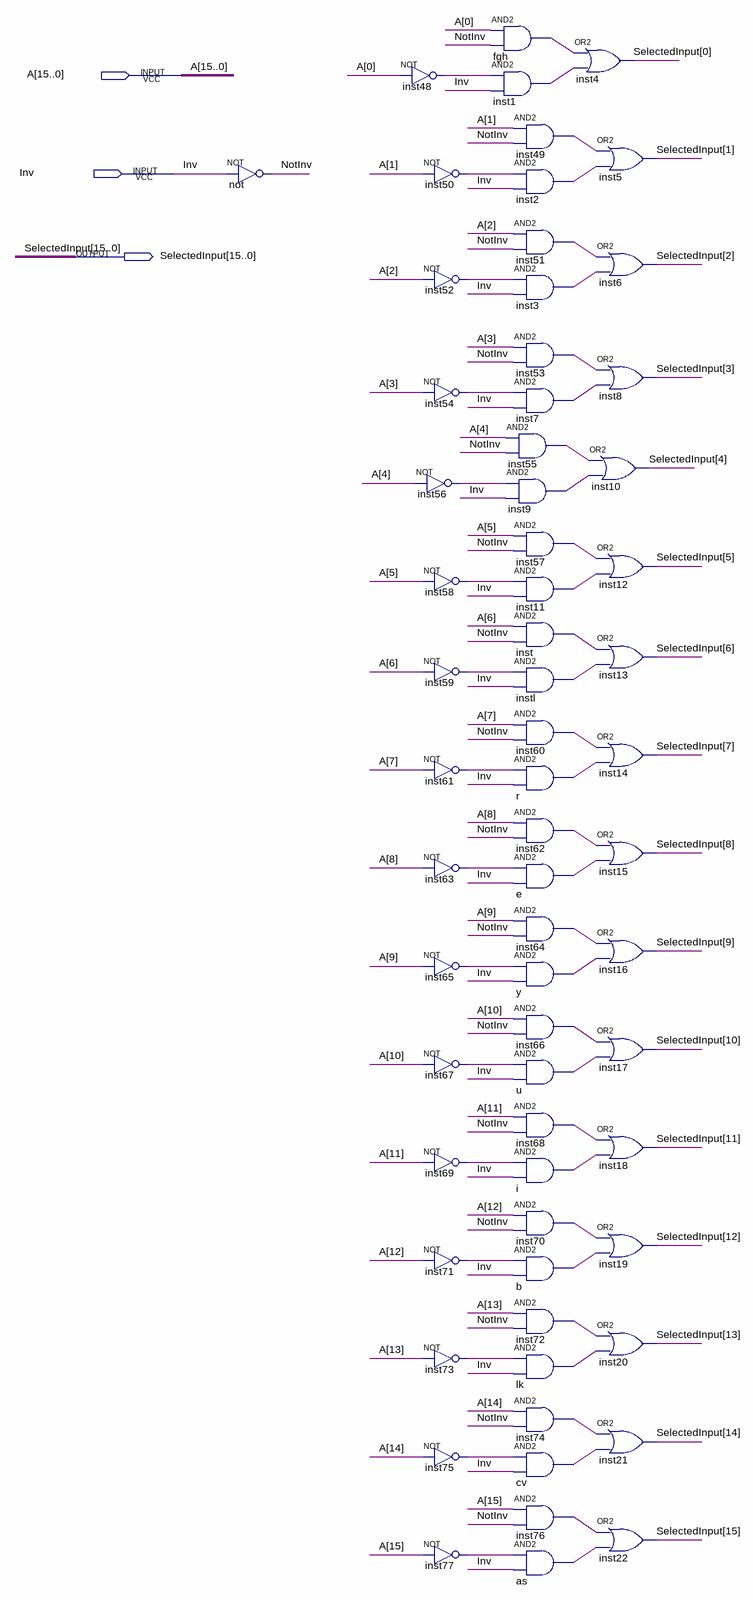
[diagram p0: schematic sheet]
// Quartus schematic InputSelector.bdf as structural Verilog: 65 symbols, 3 pins
module InputSelector (
  input  [15:0] A,
  input  Inv,
  output [15:0] SelectedInput
);

  wire as_out, b_out, cv_out, e_out, fgh_out, i_out, inst1_out, inst2_out, inst3_out, inst7_out, inst9_out,
       inst11_out, inst48_out, inst49_out, inst50_out, inst51_out, inst52_out, inst53_out, inst54_out,
       inst55_out, inst56_out, inst57_out, inst58_out, inst59_out, inst60_out, inst61_out, inst62_out,
       inst63_out, inst64_out, inst65_out, inst66_out, inst67_out, inst68_out, inst69_out, inst70_out,
       inst71_out, inst72_out, inst73_out, inst74_out, inst75_out, inst76_out, inst77_out, inst_out,
       instl_out, lk_out, NotInv, r_out, u_out, y_out;

  not \not  (NotInv, Inv);
  not inst48 (inst48_out, A[0]);
  not inst50 (inst50_out, A[1]);
  not inst52 (inst52_out, A[2]);
  not inst54 (inst54_out, A[3]);
  not inst56 (inst56_out, A[4]);
  not inst58 (inst58_out, A[5]);
  not inst59 (inst59_out, A[6]);
  not inst61 (inst61_out, A[7]);
  not inst63 (inst63_out, A[8]);
  not inst65 (inst65_out, A[9]);
  not inst67 (inst67_out, A[10]);
  not inst69 (inst69_out, A[11]);
  not inst71 (inst71_out, A[12]);
  not inst73 (inst73_out, A[13]);
  not inst75 (inst75_out, A[14]);
  not inst77 (inst77_out, A[15]);
  and fgh (fgh_out, A[0], NotInv);
  and inst1 (inst1_out, inst48_out, Inv);
  and inst49 (inst49_out, A[1], NotInv);
  and inst2 (inst2_out, inst50_out, Inv);
  and inst51 (inst51_out, A[2], NotInv);
  and inst3 (inst3_out, inst52_out, Inv);
  and inst53 (inst53_out, A[3], NotInv);
  and inst7 (inst7_out, inst54_out, Inv);
  and inst55 (inst55_out, A[4], NotInv);
  and inst9 (inst9_out, inst56_out, Inv);
  and inst57 (inst57_out, A[5], NotInv);
  and inst11 (inst11_out, inst58_out, Inv);
  and inst (inst_out, A[6], NotInv);
  and instl (instl_out, inst59_out, Inv);
  and inst60 (inst60_out, A[7], NotInv);
  and r (r_out, inst61_out, Inv);
  and inst62 (inst62_out, A[8], NotInv);
  and e (e_out, inst63_out, Inv);
  and inst64 (inst64_out, A[9], NotInv);
  and y (y_out, inst65_out, Inv);
  and inst66 (inst66_out, A[10], NotInv);
  and u (u_out, inst67_out, Inv);
  and inst68 (inst68_out, A[11], NotInv);
  and i (i_out, inst69_out, Inv);
  and inst70 (inst70_out, A[12], NotInv);
  and b (b_out, inst71_out, Inv);
  and inst72 (inst72_out, A[13], NotInv);
  and lk (lk_out, inst73_out, Inv);
  and inst74 (inst74_out, A[14], NotInv);
  and cv (cv_out, inst75_out, Inv);
  and inst76 (inst76_out, A[15], NotInv);
  and as (as_out, inst77_out, Inv);
  or inst4 (SelectedInput[0], fgh_out, inst1_out);
  or inst5 (SelectedInput[1], inst49_out, inst2_out);
  or inst6 (SelectedInput[2], inst51_out, inst3_out);
  or inst8 (SelectedInput[3], inst53_out, inst7_out);
  or inst10 (SelectedInput[4], inst55_out, inst9_out);
  or inst12 (SelectedInput[5], inst57_out, inst11_out);
  or inst13 (SelectedInput[6], inst_out, instl_out);
  or inst14 (SelectedInput[7], inst60_out, r_out);
  or inst15 (SelectedInput[8], inst62_out, e_out);
  or inst16 (SelectedInput[9], inst64_out, y_out);
  or inst17 (SelectedInput[10], inst66_out, u_out);
  or inst18 (SelectedInput[11], inst68_out, i_out);
  or inst19 (SelectedInput[12], inst70_out, b_out);
  or inst20 (SelectedInput[13], inst72_out, lk_out);
  or inst21 (SelectedInput[14], inst74_out, cv_out);
  or inst22 (SelectedInput[15], inst76_out, as_out);
endmodule
